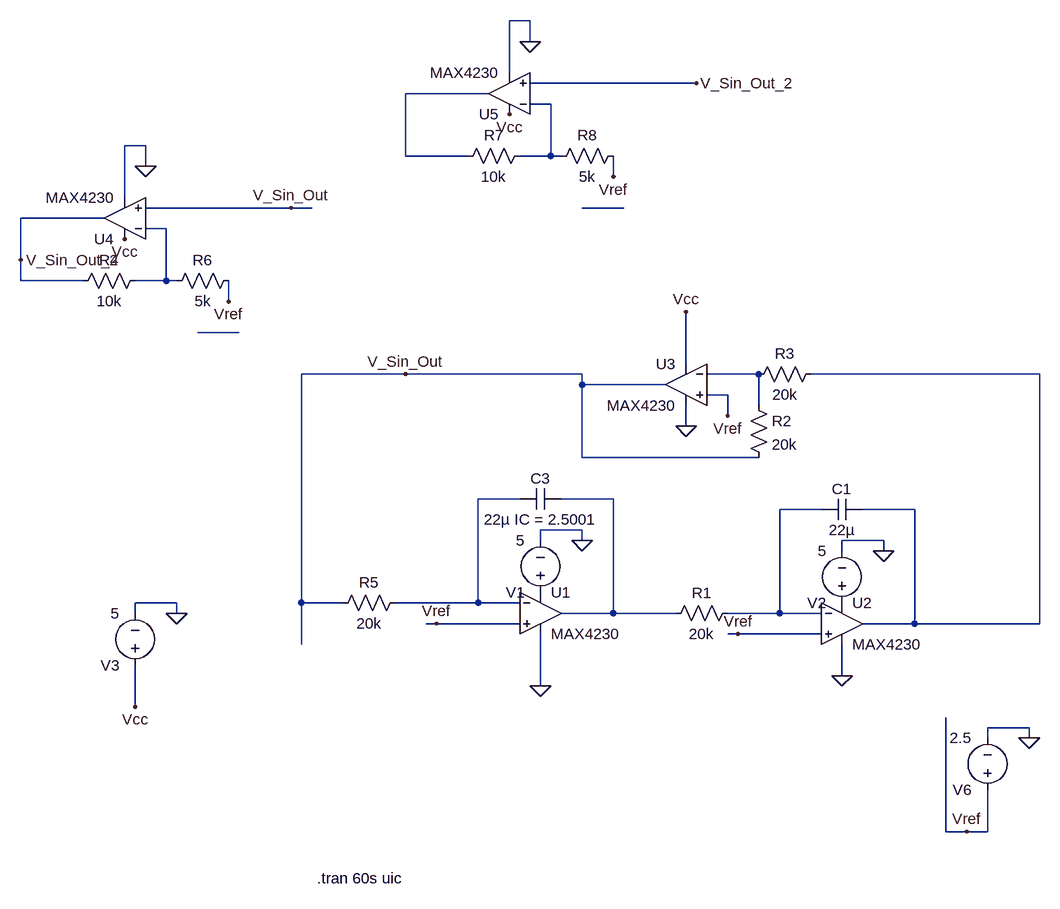
[diagram p0: schematic Draft12.asc]
Draft12.asc, the LTspice schematic file:
Version 4.1
SHEET 1 1344 680
WIRE 16 -928 -16 -928
WIRE 16 -896 16 -928
WIRE -16 -848 -16 -928
WIRE 272 -832 16 -832
WIRE -48 -816 -176 -816
WIRE 48 -800 16 -800
WIRE -576 -736 -608 -736
WIRE -176 -720 -176 -816
WIRE -80 -720 -176 -720
WIRE 48 -720 48 -800
WIRE 48 -720 0 -720
WIRE 64 -720 48 -720
WIRE -576 -704 -576 -736
WIRE 144 -688 144 -720
WIRE -608 -656 -608 -736
WIRE -352 -640 -576 -640
WIRE -320 -640 -352 -640
WIRE 160 -640 96 -640
WIRE -640 -624 -768 -624
WIRE -544 -608 -576 -608
WIRE -768 -560 -768 -624
WIRE -768 -528 -768 -560
WIRE -672 -528 -768 -528
WIRE -544 -528 -544 -608
WIRE -544 -528 -592 -528
WIRE -528 -528 -544 -528
WIRE -448 -496 -448 -528
WIRE -432 -448 -496 -448
WIRE 256 -400 256 -480
WIRE -176 -384 -336 -384
WIRE 96 -384 -176 -384
WIRE 368 -384 288 -384
WIRE 800 -384 448 -384
WIRE 96 -368 96 -384
WIRE 224 -368 96 -368
WIRE 320 -352 288 -352
WIRE 368 -336 368 -384
WIRE 320 -320 320 -352
WIRE 256 -304 256 -336
WIRE 96 -256 96 -368
WIRE 368 -256 96 -256
WIRE 0 -192 -64 -192
WIRE 144 -192 64 -192
WIRE 464 -176 400 -176
WIRE 608 -176 528 -176
WIRE 96 -144 32 -144
WIRE 32 -128 32 -144
WIRE 96 -128 96 -144
WIRE 560 -128 496 -128
WIRE 496 -112 496 -128
WIRE 560 -112 560 -128
WIRE -528 -32 -592 -32
WIRE -336 -32 -336 -384
WIRE -272 -32 -336 -32
WIRE -64 -32 -64 -192
WIRE -64 -32 -192 -32
WIRE 0 -32 -64 -32
WIRE -592 -16 -592 -32
WIRE -528 -16 -528 -32
WIRE 144 -16 144 -192
WIRE 144 -16 64 -16
WIRE 240 -16 144 -16
WIRE 400 -16 400 -176
WIRE 400 -16 320 -16
WIRE 464 -16 400 -16
WIRE -128 0 -144 0
WIRE 0 0 -128 0
WIRE 608 0 608 -176
WIRE 608 0 528 0
WIRE 800 0 800 -384
WIRE 800 0 608 0
WIRE 336 16 320 16
WIRE 464 16 336 16
WIRE -336 32 -336 -32
WIRE 496 80 496 32
WIRE 32 96 32 16
WIRE -592 128 -592 64
WIRE 784 160 720 160
WIRE 720 176 720 160
WIRE 784 176 784 160
WIRE 656 320 656 144
WIRE 688 320 656 320
WIRE 720 320 720 256
WIRE 720 320 688 320
FLAG 96 -128 0
FLAG 560 -112 0
FLAG -528 -16 0
FLAG 784 176 0
FLAG 688 320 Vref
FLAG 336 16 Vref
FLAG -128 0 Vref
FLAG -592 128 Vcc
FLAG 256 -480 Vcc
FLAG 496 80 0
FLAG 32 96 0
FLAG 256 -304 0
FLAG 320 -320 Vref
FLAG -608 -592 Vcc
FLAG -576 -704 0
FLAG -448 -496 Vref
FLAG -352 -640 V_Sin_Out
FLAG -16 -784 Vcc
FLAG 16 -896 0
FLAG 144 -688 Vref
FLAG -768 -560 V_Sin_Out_2
FLAG 272 -832 V_Sin_Out_2
FLAG -176 -384 V_Sin_Out
SYMBOL voltage 32 -32 R180
WINDOW 123 0 0 Left 0
WINDOW 39 0 0 Left 0
SYMATTR InstName V1
SYMATTR Value 5
SYMBOL cap 64 -208 R90
WINDOW 0 0 32 VBottom 2
WINDOW 3 32 32 VTop 2
SYMATTR InstName C3
SYMATTR Value 22µ IC = 2.5001
SYMATTR SpiceLine V=6.3 Irms=0 Rser=9 Lser=0
SYMBOL res -176 -48 R90
WINDOW 0 0 56 VBottom 2
WINDOW 3 32 56 VTop 2
SYMATTR InstName R5
SYMATTR Value 20k
SYMBOL OpAmps\\MAX4230 32 -80 R0
SYMATTR InstName U1
SYMBOL voltage 496 -16 R180
WINDOW 123 0 0 Left 0
WINDOW 39 0 0 Left 0
SYMATTR InstName V2
SYMATTR Value 5
SYMBOL cap 528 -192 R90
WINDOW 0 0 32 VBottom 2
WINDOW 3 32 32 VTop 2
SYMATTR InstName C1
SYMATTR Value 22µ
SYMATTR SpiceLine V=6.3 Irms=0 Rser=9 Lser=0
SYMBOL OpAmps\\MAX4230 496 -64 R0
SYMATTR InstName U2
SYMBOL OpAmps\\MAX4230 256 -432 M0
SYMATTR InstName U3
SYMBOL voltage -592 80 R180
WINDOW 123 0 0 Left 0
WINDOW 39 0 0 Left 0
SYMATTR InstName V3
SYMATTR Value 5
SYMBOL res 336 -32 R90
WINDOW 0 0 56 VBottom 2
WINDOW 3 32 56 VTop 2
SYMATTR InstName R1
SYMATTR Value 20k
SYMBOL res 352 -352 R0
SYMATTR InstName R2
SYMATTR Value 20k
SYMBOL res 464 -400 R90
WINDOW 0 0 56 VBottom 2
WINDOW 3 32 56 VTop 2
SYMATTR InstName R3
SYMATTR Value 20k
SYMBOL voltage 720 272 R180
WINDOW 123 0 0 Left 0
WINDOW 39 0 0 Left 0
SYMATTR InstName V6
SYMATTR Value 2.5
SYMBOL OpAmps\\MAX4230 -608 -560 R180
SYMATTR InstName U4
SYMBOL res -576 -544 R90
WINDOW 0 0 56 VBottom 2
WINDOW 3 32 56 VTop 2
SYMATTR InstName R4
SYMATTR Value 10k
SYMBOL res -544 -512 R270
WINDOW 0 32 56 VTop 2
WINDOW 3 0 56 VBottom 2
SYMATTR InstName R6
SYMATTR Value 5k
SYMBOL OpAmps\\MAX4230 -16 -752 R180
SYMATTR InstName U5
SYMBOL res 16 -736 R90
WINDOW 0 0 56 VBottom 2
WINDOW 3 32 56 VTop 2
SYMATTR InstName R7
SYMATTR Value 10k
SYMBOL res 48 -704 R270
WINDOW 0 32 56 VTop 2
WINDOW 3 0 56 VBottom 2
SYMATTR InstName R8
SYMATTR Value 5k
TEXT -312 392 Left 2 !.tran 60s uic

The netlist it stands for:
* Draft12.asc
V1 P001 0 5
C3 N009 N008 22µ IC = 2.5001 V=6.3 Irms=0 Rser=9 Lser=0
R5 N008 V_Sin_Out 20k
X§U1 Vref N008 P001 0 N009 MAX4230  ; pins In+ In- V+ V- OUT
V2 P002 0 5
C1 N007 N010 22µ V=6.3 Irms=0 Rser=9 Lser=0
X§U2 Vref N010 P002 0 N007 MAX4230  ; pins In+ In- V+ V- OUT
X§U3 Vref N006 Vcc 0 V_Sin_Out MAX4230  ; pins In+ In- V+ V- OUT
V3 Vcc 0 5
R1 N010 N009 20k
R2 N006 V_Sin_Out 20k
R3 N007 N006 20k
V6 Vref 0 2.5
X§U4 V_Sin_Out N004 Vcc 0 V_Sin_Out_2 MAX4230  ; pins In+ In- V+ V- OUT
R4 N004 V_Sin_Out_2 10k
R6 N004 Vref 5k
X§U5 V_Sin_Out_2 N002 Vcc 0 N001 MAX4230  ; pins In+ In- V+ V- OUT
R7 N002 N001 10k
R8 N002 Vref 5k
.tran 60s uic
.lib MAX4230.lib
.backanno
.end